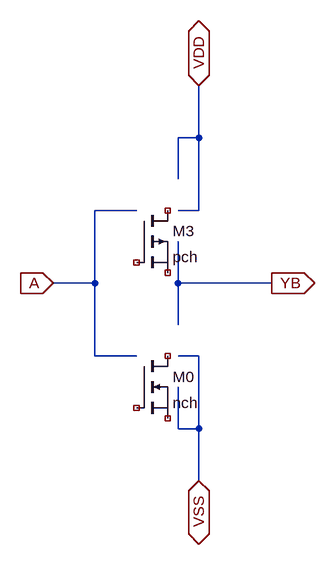
[diagram p0: schematic inv1.asc]
inv1.asc, the LTspice schematic file:
Version 4
SHEET 1 512 800
WIRE 288 400 432 400
WIRE 288 400 288 336
WIRE 288 464 288 400
WIRE 320 624 320 704
WIRE 288 624 320 624
WIRE 320 624 320 512
WIRE 288 512 320 512
WIRE 288 624 288 560
WIRE 160 400 160 288
WIRE 160 288 224 288
WIRE 160 512 224 512
WIRE 160 512 160 400
WIRE 96 400 160 400
WIRE 320 96 320 176
WIRE 288 176 320 176
WIRE 320 288 320 176
WIRE 288 288 320 288
WIRE 288 240 288 176
SYMBOL PMOS 224 288 R0
SYMATTR InstName M3
SYMATTR Value pch
SYMATTR Value2 w=6u l=1u
SYMBOL NMOS 224 512 R0
SYMATTR InstName M0
SYMATTR Value nch
SYMATTR Value2 w=2u l=1u
FLAG 432 400 YB
IOPIN 432 400 Out
FLAG 320 704 VSS
IOPIN 320 704 BiDir
FLAG 320 96 VDD
IOPIN 320 96 BiDir
FLAG 96 400 A
IOPIN 96 400 In

The netlist it stands for:
* inv1.asc
* M3: pch w=6u l=1u (symbol PMOS not certain, pin order unknown); nets seen at it: 
* M0: nch w=2u l=1u (symbol NMOS not certain, pin order unknown); nets seen at it: 
.backanno
.end